# Altium schematic sheet Sheet1.SchDoc
size A; SheetNumber: 1; SheetTotal: 1
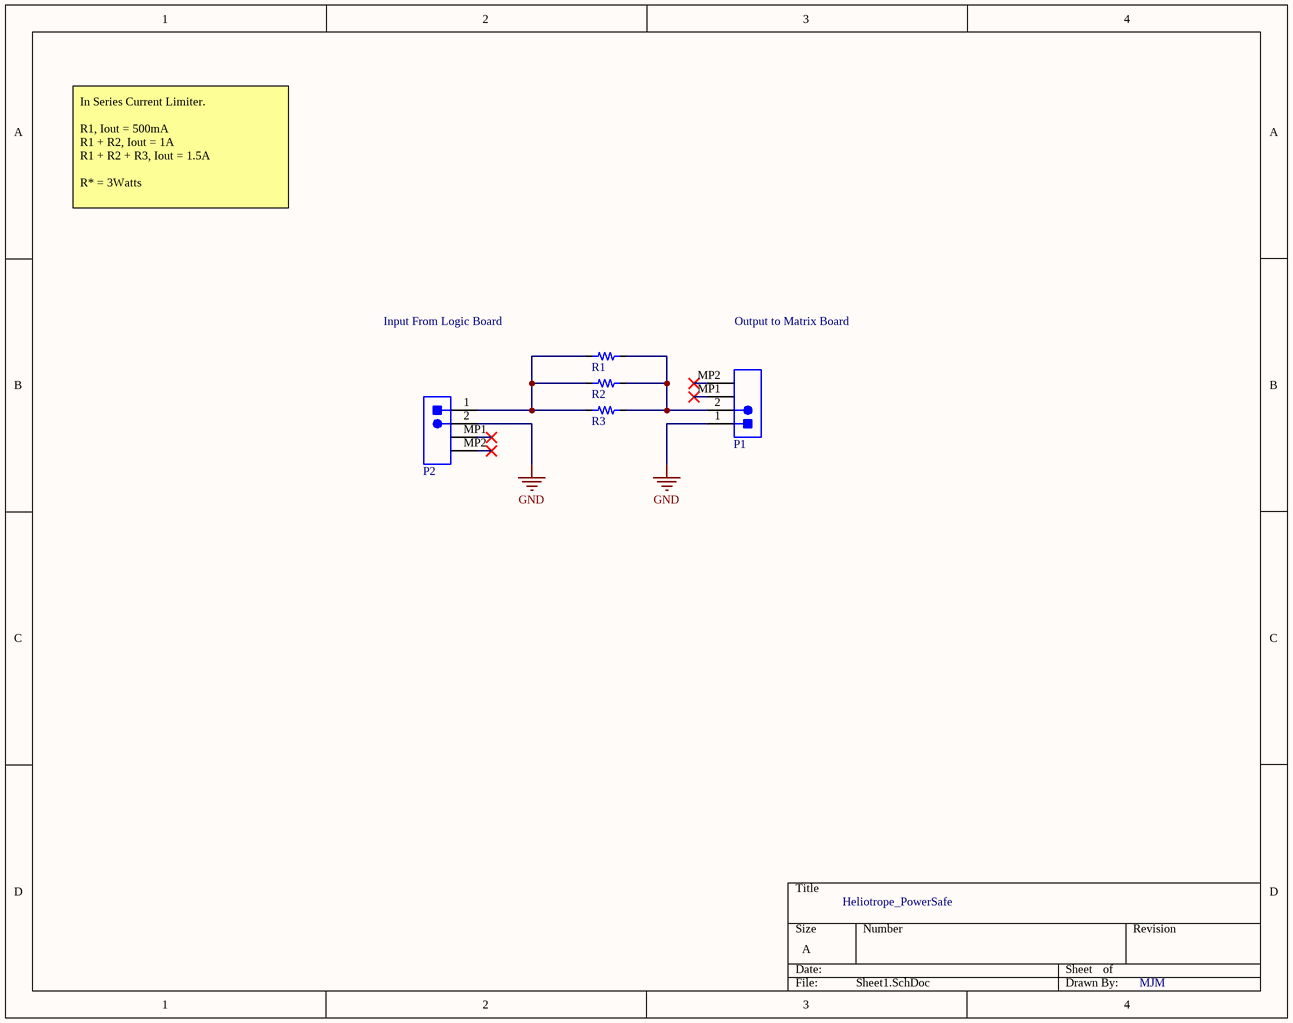
[diagram p0: Sheet1.SchDoc]

## Parts
P1  53261-0271  [MOLX-53261-0271_V]  (value not drawn)
P2  53261-0271  [MOLX-53261-0271_V]  (value not drawn)
R1  352210RFT  [RESC6331X70N]  (value not drawn)
R2  352210RFT  [RESC6331X70N]  (value not drawn)
R3  352210RFT  [RESC6331X70N]  (value not drawn)

## Nets
GND: P1.1 P2.2
NetP1_2: P1.2 R1.2 R2.2 R3.2
NetP2_1: P2.1 R1.1 R2.1 R3.1

Not connected (* = marked no-connect by the designer): P1 MP1* MP2*; P2 MP1* MP2*

## Notes on the sheet
- In Series Current Limiter.
  R1, Iout = 500mA
  R1 + R2, Iout = 1A
  R1 + R2 + R3, Iout = 1.5A
  R* = 3Watts
- Input From Logic Board
- Output to Matrix Board
- Heliotrope_PowerSafe
- MJM

## Library data of the parts
P1 P2 = CMP-042-000002-1: 1.25mm Pitch PicoBlade™ Header, Surface Mount, Right Angle, Lead-Free, 2 Circuits
R1-R3 = CMP-146-000000-4: Res Thick Film 2512 10 Ohm 1% 3W ±100ppm/C Pad SMD T/R; Package: None; Value: *; Component Type: Standard; Design Item ID: 352210RFT; Pin Count: 2; Source: 2176231-1.SchLib; Availability: Unavailable; MP: 352210RFT; Price: None